# Altium schematic sheet USB_Connector.SchDoc
size A4; SheetNumber: 2; SheetTotal: 3
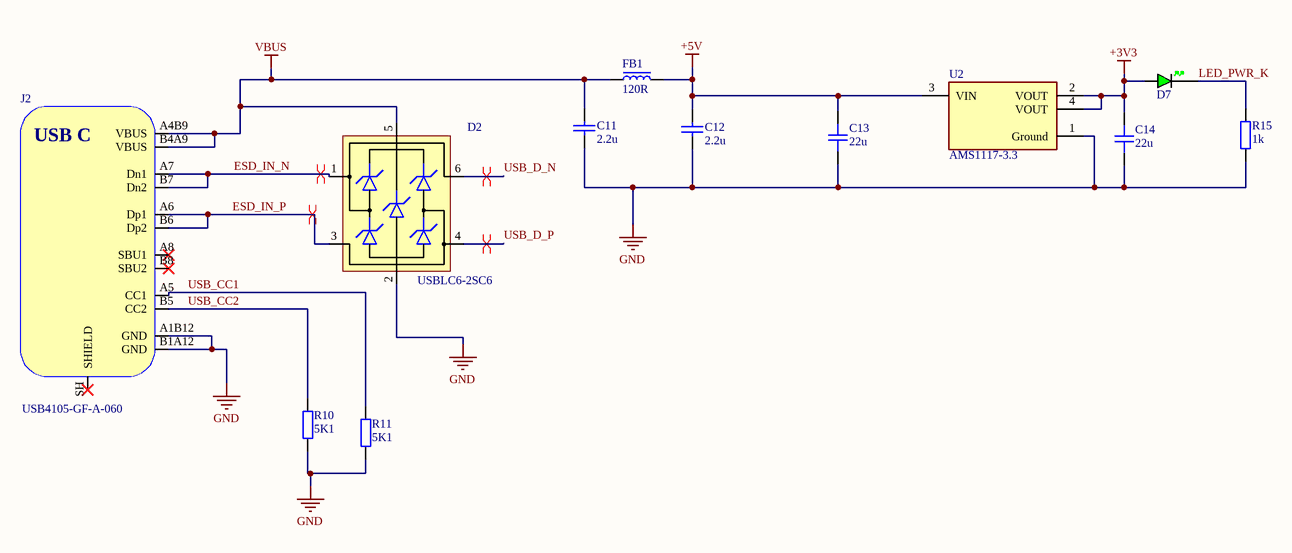
[diagram p0: USB_Connector.SchDoc]

## Parts
C11  2.2u  [CAPC1608X90X35NL15T15]
C12  2.2u  [CAPC1608X90X35NL15T15]
C13  22u  [CAP_0805]
C14  22u  [CAP_0805]
D2  USBLC6-2SC6  [SOT-23-6]
D7  GREEN  [LED_0402_GREEN]  (value not drawn)
FB1  120R  [FB_0603]
J2  USB4105-GF-A-060  [USB4105-GF-A-060]
R10  5K1  [RES_0402]
R11  5K1  [RES_0402]
R15  1k  [RES_0402]
U2  AMS1117-3.3  [FP-AMS1117-IPC_C]

## Nets
+3V3: C14.2 D7.A U2.2(VOUT) U2.4(VOUT)
+5V: C12.2 C13.2 FB1.2 U2.3(VIN)
GND: C11.1 C12.1 C13.1 C14.1 D2.2(GND) J2.A1B12(GND) J2.B1A12(GND) R10.1 R11.1 R15.1 U2.1(Ground)
VBUS: C11.2 D2.5(VBUS) FB1.1 J2.A4B9(VBUS) J2.B4A9(VBUS)
ESD_IN_N: D2.1(IO1) J2.A7(Dn1) J2.B7(Dn2)
ESD_IN_P: D2.3(IO2) J2.A6(Dp1) J2.B6(Dp2)
LED_PWR_K: D7.K R15.2
USB_CC1: J2.A5(CC1) R11.2
USB_CC2: J2.B5(CC2) R10.2
USB_D_N: D2.6(IO1)
USB_D_P: D2.4(IO2)

Not connected (* = marked no-connect by the designer): J2 A8(SBU1)* B8(SBU2)* SH(SHIELD)*

## Layout directives
differential pair; differential pair class USB_DIFF; net class USB: ESD_IN_N, ESD_IN_P, USB_D_N, USB_D_P

## Notes on the sheet
- (in symbol USB4105-GF-A-060) USB C

## Library data of the parts
C11 C12 = CMP-1035-02765-2: Manufacturer: Kemet; Part Number: C0603C225M4PACTU
C13 C14 = CAP_0805: Capacitor SMD 0805; Manufacturer: *; Manufacturer Part Number: *; Distributor Link: *; LCSC: *; Rating: *; Dielectric: *
D2 = USBLC6-2SC6: Low-Capacitance ESD Protection USB; Manufacturer: STMicroelectronics; Manufacturer Part Number: USBLC6-2SC6; Distributor Link: https://www.mouser.de/ProductDetail/STMicroelectronics/USBLC6-2SC6?qs=po45yt2pPpu%2FhNIlwQdTlg%3D%3D
D7 = LED_0402_GREEN: LED 0402 GREEN SMD
FB1 = FB_0603: Ferrite Bead SMD 0603; Manufacturer: *; Manufacturer Part Number: *; Distributor Link: *; LCSC: *
J2 = USB4105-GF-A-060: USB Connector Type C SMT 12 Pin; Manufacturer: GCT; Manufacturer Part Number: USB4105-GF-A-060; Distributor Link: https://eu.mouser.com/ProductDetail/GCT/USB4105-GF-A-060?qs=QNEnbhJQKvY2mocwNJzgfA%3D%3D
R10 R11 R15 = RES_0402: Resistor SMD 0402; Manufacturer: *; Manufacturer Part Number: *; Distributor Link: *; LCSC: *
U2 = CMP-209535-000001-1: LDO Voltage Regulators 1A, 3.3V; Manufacturer: Advanced Monolithic Systems; Dropout Voltage: 1.1V; Output Type: Fixed; Nominal Supply Current: 5mA; Max Power Dissipation: 1.2W; Max Supply Voltage: 15V; Number Of Outputs: 1; Standoff Height: 0.64mm; Max Junction Temp: +125°C; Height: 1.8mm; Package: AMS1117; Device Class L2: Power Management ICs; ComponentLink2Description: Datasheet; ComponentLink2URL: http://www.advanced-monolithic.com/pdf/ds1117.pdf; Category: IC; RoHS: TRUE; Automotive: No; Device Class L1: Integrated Circuits (ICs); Output Current: 1A; Device Class L3: Voltage Regulators - Linear; Temperature: -40°C to +125°C; Output Voltage: 3.3V; Manufacturer Part Number: AMS1117-3.3; Temperature Range Low: -40°C; Octopart: https://octopart.com/ams1117-3.3-advanced+monolithic+systems-25899300; Lead Free: Yes; Ipc Land Pattern Name: SOT229P700X180-4; Temperature Range High: +125°C